# Altium schematic sheet Sheet3.SchDoc
size 420 x 297 mm; Address1: Address1; Address2: Address2; Address3: Address3; Address4: Address4; DocumentNumber: АБВГ.123456.001 Э3; SheetNumber: 2; Scale: 1:1; DocumentType: Схема электрическая принципиальная; FirstReferrence: АБВГ.123456.001
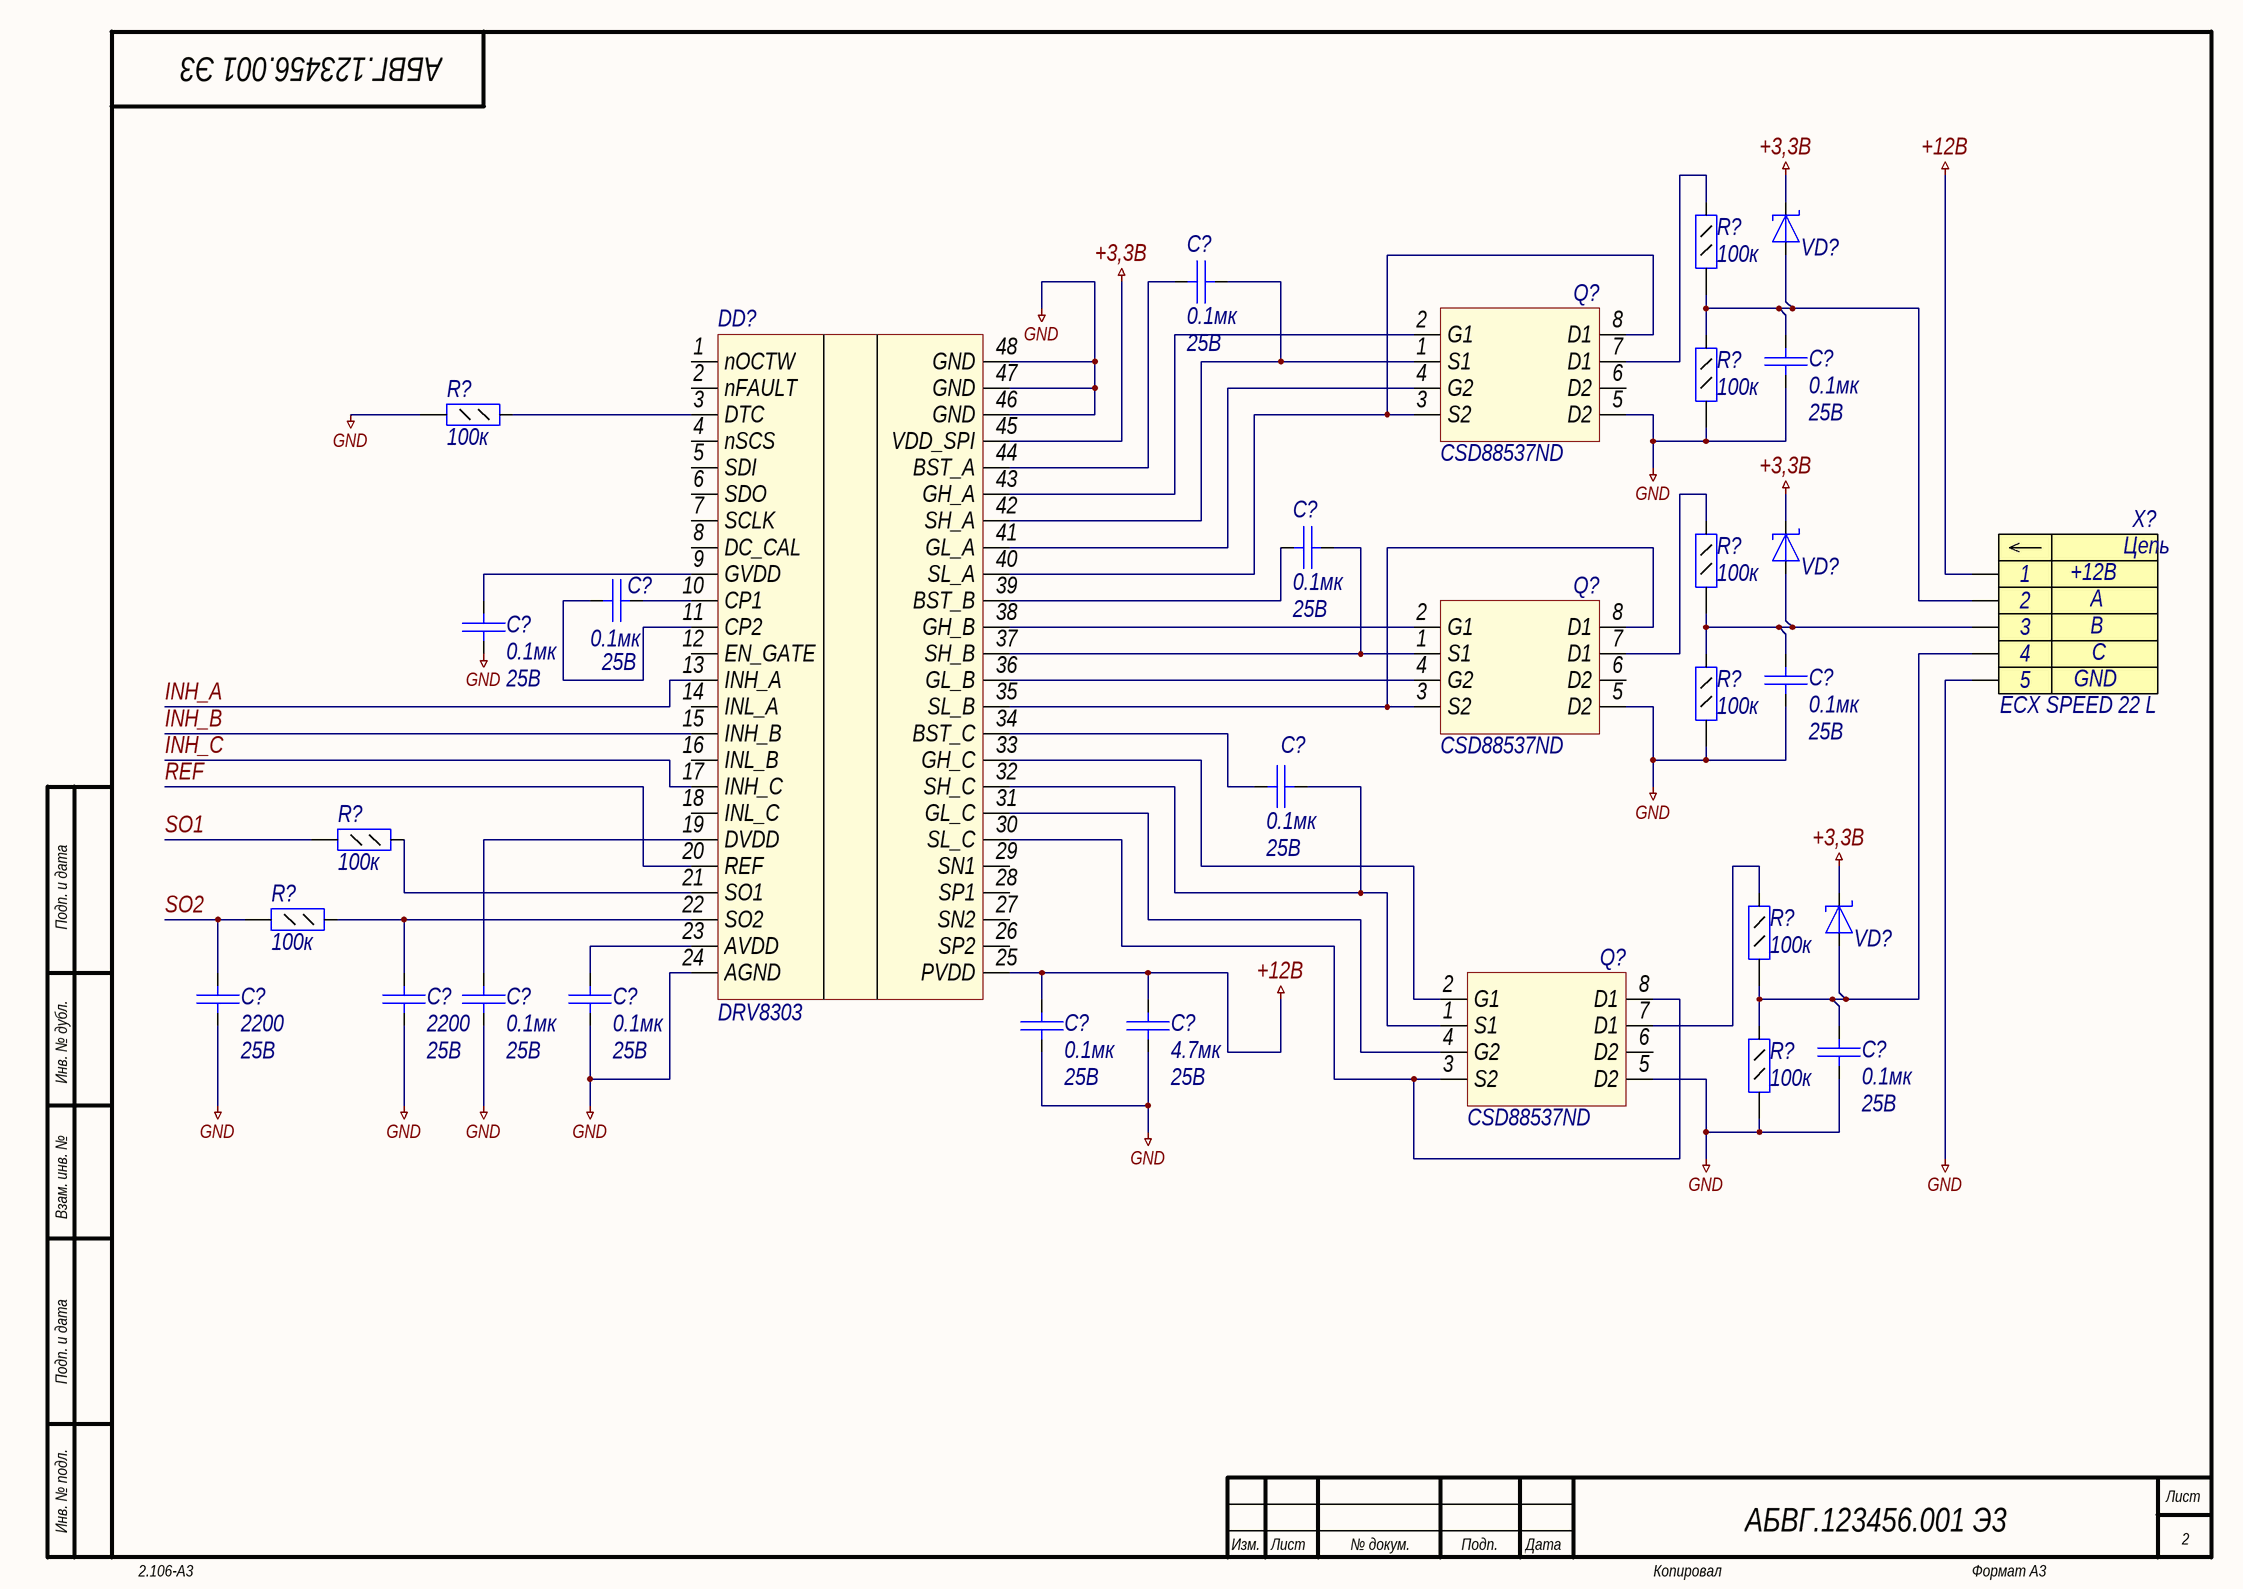
[diagram p0: Sheet3.SchDoc]

## Parts
(Parts that share a designator on the sheet are numbered #1, #2 ... from top to bottom, then left to right.)
C?#1  value 0.1мк  Voltage: 25В  [C1210]  (hidden comment: Capacitor)
C?#2  value 0.1мк  Voltage: 25В  [C1210]  (hidden comment: Capacitor)
C?#3  value 0.1мк  Voltage: 25В  [C1210]  (hidden comment: Capacitor)
C?#4  value 0.1мк  Voltage: 25В  [C1210]  (hidden comment: Capacitor)
C?#5  value 0.1мк  Voltage: 25В  [C1210]  (hidden comment: Capacitor)
C?#6  value 0.1мк  Voltage: 25В  [C1210]  (hidden comment: Capacitor)
C?#7  value 0.1мк  Voltage: 25В  [C1210]  (hidden comment: Capacitor)
C?#8  value 0.1мк  Voltage: 25В  [C1210]  (hidden comment: Capacitor)
C?#9  value 4.7мк  Voltage: 25В  [C1210]  (hidden comment: Capacitor)
C?#10  value 2200  Voltage: 25В  [C1210]  (hidden comment: Capacitor)
C?#11  value 2200  Voltage: 25В  [C1210]  (hidden comment: Capacitor)
C?#12  value 0.1мк  Voltage: 25В  [C1210]  (hidden comment: Capacitor)
C?#13  value 0.1мк  Voltage: 25В  [C1210]  (hidden comment: Capacitor)
C?#14  value 0.1мк  Voltage: 25В  [C1210]  (hidden comment: Capacitor)
DD?  DRV8303
Q?#1  CSD88537ND
Q?#2  CSD88537ND
Q?#3  CSD88537ND
R?#1  value 100к  [R0805]  (hidden comment: Resistor_0,125Вт)
R?#2  value 100к  [R0805]  (hidden comment: Resistor_0,125Вт)
R?#3  value 100к  [R0805]  (hidden comment: Resistor_0,125Вт)
R?#4  value 100к  [R0805]  (hidden comment: Resistor_0,125Вт)
R?#5  value 100к  [R0805]  (hidden comment: Resistor_0,125Вт)
R?#6  value 100к  [R0805]  (hidden comment: Resistor_0,125Вт)
R?#7  value 100к  [R0805]  (hidden comment: Resistor_0,125Вт)
R?#8  value 100к  [R0805]  (hidden comment: Resistor_0,125Вт)
R?#9  value 100к  [R0805]  (hidden comment: Resistor_0,125Вт)
VD?#1  Diod Schottky  [DO214AA]  (value not drawn)
VD?#2  Diod Schottky  [DO214AA]  (value not drawn)
VD?#3  Diod Schottky  [DO214AA]  (value not drawn)
X?  ECX SPEED 22 L  U: +12В  Hall1: A  Hall2: B  Hall3: C  [USB]

## Nets
+3,3В: DD?.45(VDD_SPI) VD?#1.2 VD?#2.2 VD?#3.2
+12В: C?#8.1 C?#9.1 DD?.25(PVDD) X?.1
GND: C?#2.2 C?#5.1 C?#6.2 C?#8.2 C?#9.2 C?#10.1 C?#11.1 C?#12.1 C?#13.1 C?#14.2 DD?.24(AGND) DD?.46(GND) DD?.47(GND) DD?.48(GND) Q?#1.5(D2) Q?#2.5(D2) Q?#3.5(D2) R?#2.2 R?#3.2 R?#5.2 R?#9.2 X?.5
INH_A: DD?.13(INH_A)
INH_B: DD?.15(INH_B)
INH_C: DD?.17(INH_C)
REF: DD?.20(REF)
SO1: R?#6.2
SO2: C?#10.2 R?#8.2
NetC?#1_1: C?#1.1 DD?.42(SH_A) Q?#1.1(S1)
NetC?#1_2: C?#1.2 DD?.44(BST_A)
NetC?#2_1: C?#2.1 R?#1.2 R?#2.1 VD?#1.1 X?.2
NetC?#3_1: C?#3.1 DD?.37(SH_B) Q?#2.1(S1)
NetC?#3_2: C?#3.2 DD?.39(BST_B)
NetC?#4_1: C?#4.1 DD?.11(CP2)
NetC?#4_2: C?#4.2 DD?.10(CP1)
NetC?#5_2: C?#5.2 DD?.9(GVDD)
NetC?#6_1: C?#6.1 R?#4.2 R?#5.1 VD?#2.1 X?.3
NetC?#7_1: C?#7.1 DD?.32(SH_C) Q?#3.1(S1)
NetC?#7_2: C?#7.2 DD?.34(BST_C)
NetC?#11_2: C?#11.2 DD?.22(SO2) R?#8.1
NetC?#12_2: C?#12.2 DD?.19(DVDD)
NetC?#13_2: C?#13.2 DD?.23(AVDD)
NetC?#14_1: C?#14.1 R?#7.2 R?#9.1 VD?#3.1 X?.4
NetDD?_3: DD?.3(DTC) R?#3.1
NetDD?_21: DD?.21(SO1) R?#6.1
NetDD?_30: DD?.30(SL_C) Q?#3.3(S2) Q?#3.8(D1)
NetDD?_31: DD?.31(GL_C) Q?#3.4(G2)
NetDD?_33: DD?.33(GH_C) Q?#3.2(G1)
NetDD?_35: DD?.35(SL_B) Q?#2.3(S2) Q?#2.8(D1)
NetDD?_36: DD?.36(GL_B) Q?#2.4(G2)
NetDD?_38: DD?.38(GH_B) Q?#2.2(G1)
NetDD?_40: DD?.40(SL_A) Q?#1.3(S2) Q?#1.8(D1)
NetDD?_41: DD?.41(GL_A) Q?#1.4(G2)
NetDD?_43: DD?.43(GH_A) Q?#1.2(G1)
NetQ?#1_7: Q?#1.7(D1) R?#1.1
NetQ?#2_7: Q?#2.7(D1) R?#4.1
NetQ?#3_7: Q?#3.7(D1) R?#7.1

Not connected (* = marked no-connect by the designer): DD? 1(nOCTW) 2(nFAULT) 4(nSCS) 5(SDI) 6(SDO) 7(SCLK) 8(DC_CAL) 12(EN_GATE) 14(INL_A) 16(INL_B) 18(INL_C) 26(SP2) 27(SN2) 28(SP1) 29(SN1); Q?#1 6(D2); Q?#2 6(D2); Q?#3 6(D2)

## Notes on the sheet
- Подп. и дата
- Инв. № дубл.
- Взам. инв. №
- Инв. № подл.
- Изм.
- Лист
- № докум.
- Подп.
- Дата
- 2.106-A3
- Копировал
- Формат А3
- (in symbol HallSensor) Цепь

## Library data of the parts
C?#1-C?#14 = cap194: Конденсатор; Part Name: Capacitors; Manufacture: Murata; Part Number: GRM32ER61A106K; id: cap194; TKE: X7R
Q?#1-Q?#3 = CSD8837ND: Model: CSD88537ND
R?#1-R?#9 = res121: Резистор; id: res121; Accuracy: 1%; Part Name: Resistor; Power: 0,125Вт
VD?#1-VD?#3 = Diod Schottky: Manufacturer: Rectron; Model: FM5822B-W; If: 3А; Vrrm: 40В; ComponentKind: *; HelpURL: https://ru.mouser.com/ProductDetail/Rectron/FM5822B-W?qs=sGAEpiMZZMtQ8nqTKtFS%2fGuc2LbLh1yNV0sywe9%2fy3k%3d
X? = HallSensor: http://pdf.directindustry.com/pdf/maxon-motor/ecx-speed-22-l-22-mm/7173-699958.html; Create: DeathSpeaker; GND: GND
DD? = DRV8303: Model: DRV8303